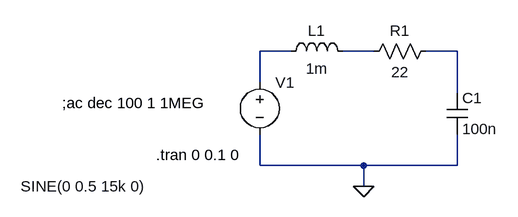
[diagram p0: schematic aufgabe3_RLC.asc]
aufgabe3_RLC.asc, the LTspice schematic file:
Version 4
SHEET 1 880 680
WIRE 64 80 16 80
WIRE 192 80 144 80
WIRE 320 80 272 80
WIRE 16 128 16 80
WIRE 320 144 320 80
WIRE 16 256 16 208
WIRE 176 256 16 256
WIRE 320 256 320 208
WIRE 320 256 176 256
WIRE 176 288 176 256
FLAG 176 288 0
SYMBOL voltage 16 112 R0
WINDOW 123 -368 148 Left 2
WINDOW 39 0 0 Left 2
WINDOW 3 -368 176 Left 2
SYMATTR InstName V1
SYMATTR Value SINE(0 0.5 15k 0)
SYMBOL res 288 64 R90
WINDOW 0 0 56 VBottom 2
WINDOW 3 32 56 VTop 2
SYMATTR InstName R1
SYMATTR Value 22
SYMBOL cap 304 144 R0
SYMATTR InstName C1
SYMATTR Value 100n
SYMBOL ind 48 96 R270
WINDOW 0 32 56 VTop 2
WINDOW 3 5 56 VBottom 2
SYMATTR InstName L1
SYMATTR Value 1m
SYMATTR SpiceLine Rser=0
TEXT -288 160 Left 2 !;ac dec 100 1 1MEG
TEXT -144 240 Left 2 !.tran 0 0.1 0

The netlist it stands for:
* aufgabe3_RLC.asc
V1 N001 0 SINE(0 0.5 15k 0)
R1 N003 N002 22
C1 N003 0 100n
L1 N001 N002 1m Rser=0
;ac dec 100 1 1MEG
.tran 0 0.1 0
.backanno
.end